# Altium schematic sheet SecurityHost_v1.0.SchDoc
size A3; SheetNumber: 1; SheetTotal: 1
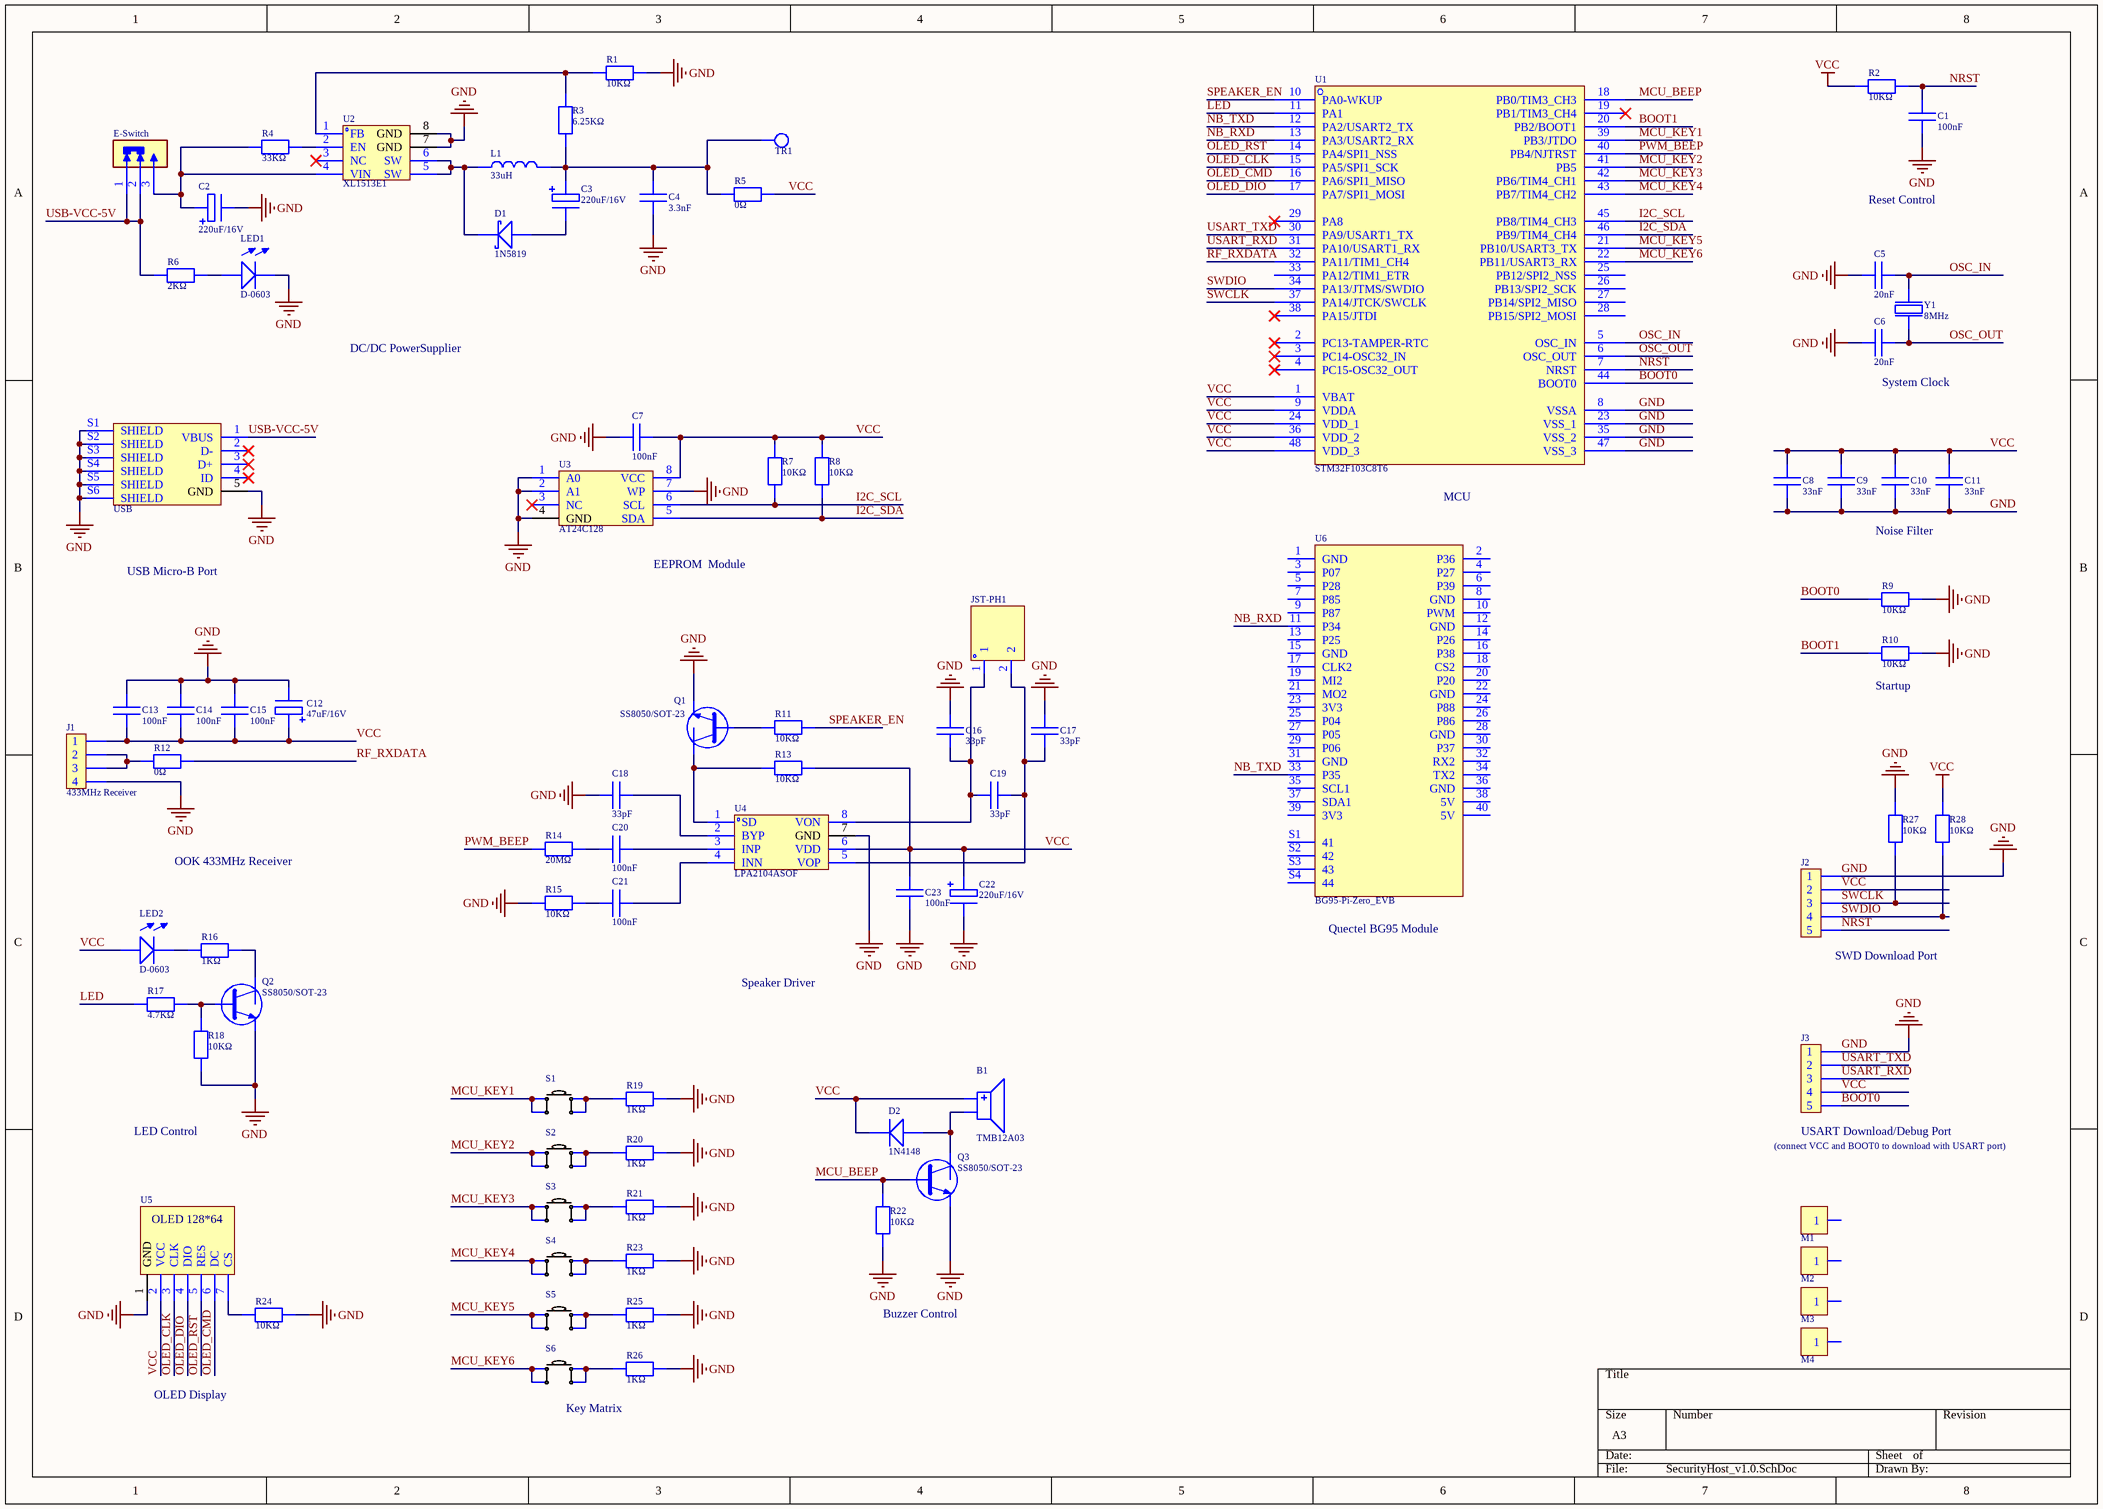
[diagram p0: SecurityHost_v1.0.SchDoc]

## Parts
B1  TMB12A03  [Buzzer_TH_BD12.0]
C1  100nF  [C0603]
C2  220uF/16V  [C(Electrolytic)_SMD-D6.3mm_L7.7mm]
C3  220uF/16V  [C(Electrolytic)_SMD-D6.3mm_L7.7mm]
C4  3.3nF  [C0603]
C5  20nF  [C0603]
C6  20nF  [C0603]
C7  100nF  [C0603]
C8  33nF  [C0603]
C9  33nF  [C0603]
C10  33nF  [C0603]
C11  33nF  [C0603]
C12  47uF/16V  [C(Electrolytic)_SMD-D6.3mm_L7.7mm]
C13  100nF  [C0603]
C14  100nF  [C0603]
C15  100nF  [C0603]
C16  33pF  [C0603]
C17  33pF  [C0603]
C18  33pF  [C0603]
C19  33pF  [C0603]
C20  100nF  [C0603]
C21  100nF  [C0603]
C22  220uF/16V  [C(Electrolytic)_SMD-D6.3mm_L7.7mm]
C23  100nF  [C0603]
D1  1N5819  [SOD-123F]
D2  1N4148  [SOD-123]
E-Switch  E-Switch_3Pin-Slide  [E-Switch_3Pin-Slide]  (value not drawn)
J1  433MHz Receiver  [PinSocket_4Pin-2.54mm]
J2  SWD Download Port  [PinHeader_5Pin-2.54mm]  (value not drawn)
J3  PinHeader_5Pin  [PinHeader_5Pin-2.54mm]  (value not drawn)
JST-PH1  JST-PH2.0_2Pin-TH-Vertical  [Connector-JST-PH2.0-2Pin_TH-Vertical]  (value not drawn)
L1  33uH  [L1040-Integrated Molded]
LED1  D-0603  [LED0603-Castellated]
LED2  D-0603  [LED0603-Castellated]
M1  PCB Mounting Hole  [PCB Mounting Hole]  (value not drawn)
M2  PCB Mounting Hole  [PCB Mounting Hole]  (value not drawn)
M3  PCB Mounting Hole  [PCB Mounting Hole]  (value not drawn)
M4  PCB Mounting Hole  [PCB Mounting Hole]  (value not drawn)
Q1  SS8050/SOT-23  [SOT-23-3]
Q2  SS8050/SOT-23  [SOT-23-3]
Q3  SS8050/SOT-23  [SOT-23-3]
R1  10KΩ  [R0805]
R2  10KΩ  [R0603]
R3  6.25KΩ  [R0805]
R4  33KΩ  [R0603]
R5  0Ω  [R0805]
R6  2KΩ  [R0805]
R7  10KΩ  [R0603]
R8  10KΩ  [R0603]
R9  10KΩ  [R0603]
R10  10KΩ  [R0603]
R11  10KΩ  [R0603]
R12  0Ω  [R0805]
R13  10KΩ  [R0603]
R14  20MΩ  [R0603]
R15  10KΩ  [R0603]
R16  1KΩ  [R0603]
R17  4.7KΩ  [R0603]
R18  10KΩ  [R0603]
R19  1KΩ  [R0603]
R20  1KΩ  [R0603]
R21  1KΩ  [R0603]
R22  10KΩ  [R0603]
R23  1KΩ  [R0603]
R24  10KΩ  [R0603]
R25  1KΩ  [R0603]
R26  1KΩ  [R0603]
R27  10KΩ  [R0603]
R28  10KΩ  [R0603]
S1  Button_Push_4Pin_TH  [Tactile Switch_TH_SPST-L6.0-W6.0]  (value not drawn)
S2  Button_Push_4Pin_TH  [Tactile Switch_TH_SPST-L6.0-W6.0]  (value not drawn)
S3  Button_Push_4Pin_TH  [Tactile Switch_TH_SPST-L6.0-W6.0]  (value not drawn)
S4  Button_Push_4Pin_TH  [Tactile Switch_TH_SPST-L6.0-W6.0]  (value not drawn)
S5  Button_Push_4Pin_TH  [Tactile Switch_TH_SPST-L6.0-W6.0]  (value not drawn)
S6  Button_Push_4Pin_TH  [Tactile Switch_TH_SPST-L6.0-W6.0]  (value not drawn)
TR1  Test Ring  [Test Ring_TH-BD2.54mm]  (value not drawn)
U1  STM32F103C8T6  [LQFP_48Pin_L7.0-W7.0-P0.5]
U2  XL1513E1  [SOIC_8Pin-L5.0-W4.0]
U3  AT24C128  [SOIC_8Pin-L5.0-W4.0]
U4  LPA2104ASOF  [SOIC_8Pin-L5.0-W4.0]
U5  OLED Display_7Pin  [OLED Display_7Pin]  (value not drawn)
U6  BG95-Pi-Zero_EVB  [Quectel-BG95-Pi-Zero_EVB_PinSocket]
USB  USB_Micro-B-Molex  [USB_Micro-B]  (value not drawn)
Y1  8MHz  [Crystal_TH_HC-49S-L11.5-W4.5]

## Nets
GND: C1.1 C2.2 C4.1 C5.1 C6.1 C7.1 C8.1 C9.1 C10.1 C11.1 C12.2 C13.2 C14.2 C15.2 C16.2 C17.2 C18.2 C22.2 C23.2 J1.4 J2.1 J3.1 LED1.2 Q1.2 Q2.2 Q3.2 R1.2 R9.2 R10.2 R15.1 R18.1 R19.2 R20.2 R21.2 R22.1 R23.2 R24.2 R25.2 R26.2 R27.2 U1.8(VSSA) U1.23(VSS_1) U1.35(VSS_2) U1.47(VSS_3) U2.7(GND) U2.8(GND) U3.1(A0) U3.2(A1) U3.4(GND) U3.7(WP) U4.7(GND) U5.1(GND) USB.5(GND) USB.S1(SHIELD) USB.S2(SHIELD) USB.S3(SHIELD) USB.S4(SHIELD) USB.S5(SHIELD) USB.S6(SHIELD)
VCC: B1.1 C7.2 C8.2 C9.2 C10.2 C11.2 C12.1 C13.1 C14.1 C15.1 C22.1 C23.1 D2.1 J1.1 J2.2 J3.4 LED2.1 R2.1 R5.2 R7.2 R8.2 R13.2 R28.2 U1.1(VBAT) U1.9(VDDA) U1.24(VDD_1) U1.36(VDD_2) U1.48(VDD_3) U3.8(VCC) U4.6(VDD) U5.2(VCC)
BOOT0: J3.5 R9.1 U1.44(BOOT0)
BOOT1: R10.1 U1.20(PB2/BOOT1)
I2C_SCL: R7.1 U1.45(PB8/TIM4_CH3) U3.6(SCL)
I2C_SDA: R8.1 U1.46(PB9/TIM4_CH4) U3.5(SDA)
LED: R17.1 U1.11(PA1)
MCU_BEEP: Q3.1 R22.2 U1.18(PB0/TIM3_CH3)
MCU_KEY1: S1.1 S1.2 U1.39(PB3/JTDO)
MCU_KEY2: S2.1 S2.2 U1.41(PB5)
MCU_KEY3: S3.1 S3.2 U1.42(PB6/TIM4_CH1)
MCU_KEY4: S4.1 S4.2 U1.43(PB7/TIM4_CH2)
MCU_KEY5: S5.1 S5.2 U1.21(PB10/USART3_TX)
MCU_KEY6: S6.1 S6.2 U1.22(PB11/USART3_RX)
NB_RXD: U1.13(PA3/USART2_RX) U6.11(P34)
NB_TXD: U1.12(PA2/USART2_TX) U6.33(P35)
NRST: C1.2 J2.5 R2.2 U1.7(NRST)
OLED_CLK: U1.15(PA5/SPI1_SCK) U5.3(CLK)
OLED_CMD: U1.16(PA6/SPI1_MISO) U5.6(DC)
OLED_DIO: U1.17(PA7/SPI1_MOSI) U5.4(DIO)
OLED_RST: U1.14(PA4/SPI1_NSS) U5.5(RES)
OSC_IN: C5.2 U1.5(OSC_IN) Y1.2
OSC_OUT: C6.2 U1.6(OSC_OUT) Y1.1
PWM_BEEP: R14.1 U1.40(PB4/NJTRST)
RF_RXDATA: R12.2 U1.32(PA11/TIM1_CH4)
SPEAKER_EN: R11.1 U1.10(PA0-WKUP)
SWCLK: J2.3 R27.1 U1.37(PA14/JTCK/SWCLK)
SWDIO: J2.4 R28.1 U1.34(PA13/JTMS/SWDIO)
USART_RXD: J3.3 U1.31(PA10/USART1_RX)
USART_TXD: J3.2 U1.30(PA9/USART1_TX)
USB-VCC-5V: E-Switch.1(NC) E-Switch.2(COM) R6.1 USB.1(VBUS)
NetB1_2: B1.2 D2.2 Q3.3
NetC2_1: C2.1 E-Switch.3(NO) R4.1 U2.4(VIN)
NetC3_1: C3.1 C4.2 L1.2 R3.1 R5.1 TR1.1
NetC3_2: C3.2 D1.2
NetC16_1: C16.1 C19.1 JST-PH1.1 U4.8(VON)
NetC17_1: C17.1 C19.2 JST-PH1.2 U4.5(VOP)
NetC18_1: C18.1 U4.2(BYP)
NetC20_1: C20.1 R14.2
NetC20_2: C20.2 U4.3(INP)
NetC21_1: C21.1 R15.2
NetC21_2: C21.2 U4.4(INN)
NetD1_1: D1.1 L1.1 U2.5(SW) U2.6(SW)
NetJ1_2: J1.2 J1.3 R12.1
NetLED1_1: LED1.1 R6.2
NetLED2_2: LED2.2 R16.1
NetQ1_1: Q1.1 R11.2
NetQ1_3: Q1.3 R13.1 U4.1(SD)
NetQ2_1: Q2.1 R17.2 R18.2
NetQ2_3: Q2.3 R16.2
NetR1_1: R1.1 R3.2 U2.1(FB)
NetR4_2: R4.2 U2.2(EN)
NetR19_1: R19.1 S1.3 S1.4
NetR20_1: R20.1 S2.3 S2.4
NetR21_1: R21.1 S3.3 S3.4
NetR23_1: R23.1 S4.3 S4.4
NetR24_1: R24.1 U5.7(CS)
NetR25_1: R25.1 S5.3 S5.4
NetR26_1: R26.1 S6.3 S6.4

Not connected (* = marked no-connect by the designer): M1 1; M2 1; M3 1; M4 1; U1 2(PC13-TAMPER-RTC)* 3(PC14-OSC32_IN)* 4(PC15-OSC32_OUT)* 19(PB1/TIM3_CH4)* 25(PB12/SPI2_NSS) 26(PB13/SPI2_SCK) 27(PB14/SPI2_MISO) 28(PB15/SPI2_MOSI) 29(PA8)* 33(PA12/TIM1_ETR) 38(PA15/JTDI)*; U2 3(NC)*; U3 3(NC)*; U6 1(GND) 2(P36) 3(P07) 4(P27) 5(P28) 6(P39) 7(P85) 8(GND) 9(P87) 10(PWM) 12(GND) 13(P25) 14(P26) 15(GND) 16(P38) 17(CLK2) 18(CS2) 19(MI2) 20(P20) 21(MO2) 22(GND) 23(3V3) 24(P88) 25(P04) 26(P86) 27(P05) 28(GND) 29(P06) 30(P37) 31(GND) 32(RX2) 34(TX2) 35(SCL1) 36(GND) 37(SDA1) 38(5V) 39(3V3) 40(5V) S1(41) S2(42) S3(43) S4(44); USB 2(D-)* 3(D+)* 4(ID)*

## Notes on the sheet
- Reset Control
- DC/DC PowerSupplier
- (near C6) System Clock
- MCU
- USB Micro-B Port
- (near U3) EEPROM  Module
- Noise Filter
- (near R10) Startup
- OOK 433MHz Receiver
- Speaker Driver
- (near U6) Quectel BG95 Module
- (near J2) SWD Download Port
- LED Control
- (near J3) (connect VCC and BOOT0 to download with USART port)
- (near J3) USART Download/Debug Port
- Buzzer Control
- OLED Display
- Key Matrix
- (in symbol OLED Display_7Pin) OLED 128*64

## Library data of the parts
B1 = Buzzer_TMB12A03: Value: TMB12A03
C1 C4-C11 C13-C21 C23 = Capacitor_0603
  C1 C7 C13-C15 C20 C21 C23: Value: 100nF
  C4: Value: 3.3nF
  C5 C6: Value: 20nF
  C8-C11: Value: 33nF
  C16-C19: Value: 33pF
C2 C3 C12 C22 = Capacitor_Electrolytic-SMD
  C2 C3 C22: Value: 220uF/16V
  C12: Value: 47uF/16V
D1 = Schottky Diodes_SOD123F: Value: 1N5819
D2 = Diode-FastSwitching_SOD123: Value: 1N4148
J1 = PinSocket_4Pin: Straight Single Row, Square Pitch, 2.54mm
J2 J3 = PinHeader_5Pin: Straight Single Row, Square Pitch, 2.54mm
L1 = Inductor_Integrated Molded_1040: Value: 33uH
LED1 LED2 = LED_0603: Value: D-0603
M1-M4 = PCB Mounting Hole: Mounting Hole
Q1-Q3 = NPN_SOT-23-3: Value: SS8050/SOT-23
R1 R3 R5 R12 = Resistor_0805
  R1: Value: 10KΩ
  R3: Value: 6.25KΩ
  R5 R12: Value: 0Ω
R2 R4 R7-R11 R13-R28 = Resistor_0603
  R2 R7-R11 R13 R15 R18 R22 R24 R27 R28: Value: 10KΩ
  R4: Value: 33KΩ
  R14: Value: 20MΩ
  R16 R19-R21 R23 R25 R26: Value: 1KΩ
  R17: Value: 4.7KΩ
R6 = Resistor_0805: Value: 10KΩ
U1 = STM32_LQFP-48Pin-7x7mm: Value: STM32F103C8T6
U2 = DC/DC Converter_XL1513_SOP8: 3.6V to 18V Input, 0.8V to 16V Output, Step-down type 2A
U3 = EEPROM_AT24C128_SOP8: Value: AT24C128
U4 = Audio Amplifier_SOP8: Value: LPA2104ASOF
U5 = OLED Display_7Pin: 0.96'', 128x64
U6 = Quectel-BG95-Pi-Zero_EVB: P34: USART4_RX, P35: USART4_TX
Y1 = Crystal_2Pin_TH: Value: 8MHz